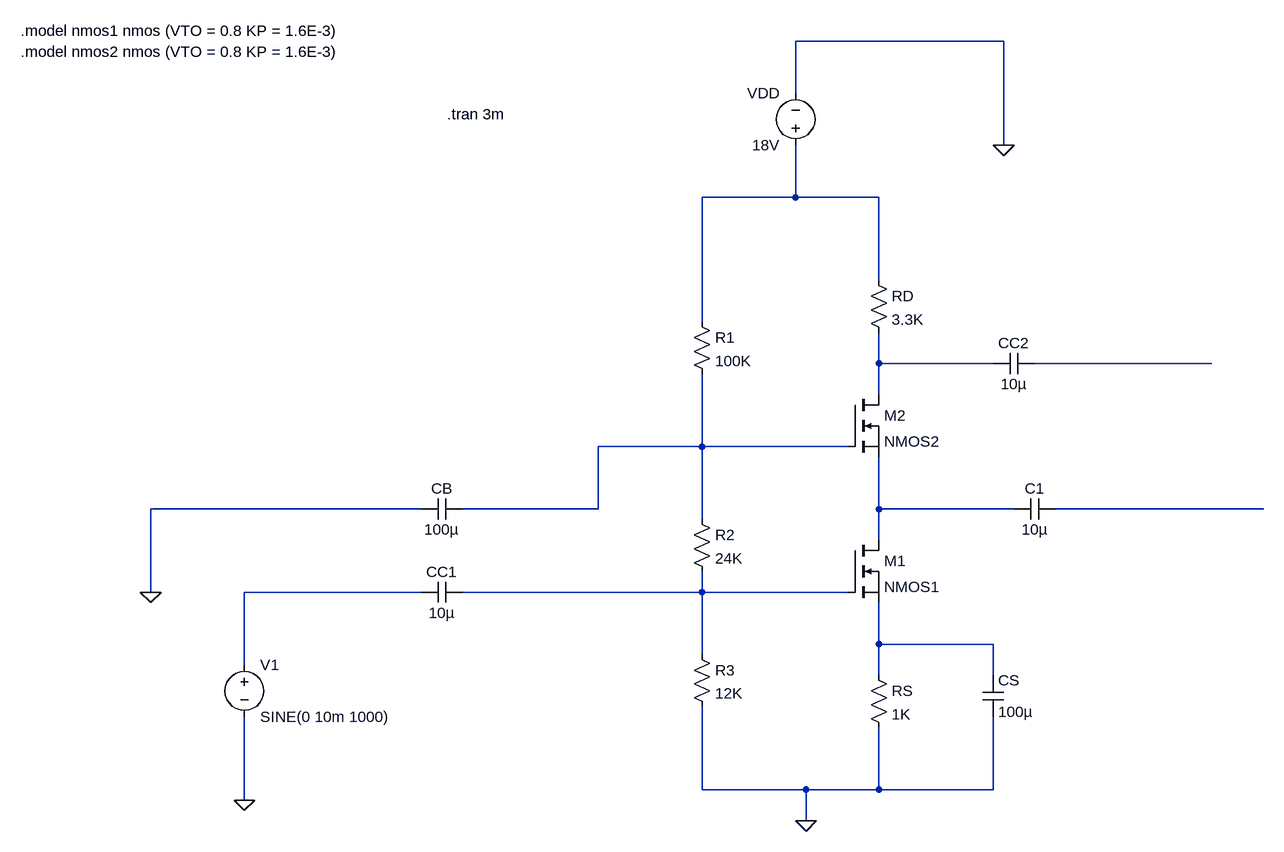
[diagram p0: schematic ec_exp2.asc]
ec_exp2.asc, the LTspice schematic file:
Version 4
SHEET 1 1188 680
WIRE 784 -816 464 -816
WIRE 464 -736 464 -816
WIRE 784 -656 784 -816
WIRE 464 -576 464 -656
WIRE 464 -576 320 -576
WIRE 592 -576 464 -576
WIRE 592 -448 592 -576
WIRE 320 -384 320 -576
WIRE 592 -320 592 -368
WIRE 768 -320 592 -320
WIRE 1104 -320 832 -320
WIRE 592 -272 592 -320
WIRE 320 -192 320 -304
WIRE 320 -192 160 -192
WIRE 544 -192 320 -192
WIRE -112 -96 -528 -96
WIRE 160 -96 160 -192
WIRE 160 -96 -48 -96
WIRE 592 -96 592 -176
WIRE 800 -96 592 -96
WIRE 1184 -96 864 -96
WIRE 320 -80 320 -192
WIRE 592 -48 592 -96
WIRE -528 32 -528 -96
WIRE -112 32 -384 32
WIRE 320 32 320 0
WIRE 320 32 -48 32
WIRE 544 32 320 32
WIRE 592 112 592 48
WIRE 768 112 592 112
WIRE 320 128 320 32
WIRE -384 144 -384 32
WIRE 592 160 592 112
WIRE 768 160 768 112
WIRE 320 336 320 208
WIRE 480 336 320 336
WIRE 592 336 592 240
WIRE 592 336 480 336
WIRE 768 336 768 224
WIRE 768 336 592 336
WIRE -384 352 -384 224
WIRE 480 384 480 336
FLAG 480 384 0
FLAG -384 352 0
FLAG -528 32 0
FLAG 784 -656 0
SYMBOL cap -48 16 R90
WINDOW 0 0 32 VBottom 2
WINDOW 3 32 32 VTop 2
SYMATTR InstName CC1
SYMATTR Value 10µ
SYMBOL voltage -384 128 R0
WINDOW 123 0 0 Left 0
WINDOW 39 0 0 Left 0
SYMATTR InstName V1
SYMATTR Value SINE(0 10m 1000)
SYMBOL res 304 112 R0
SYMATTR InstName R3
SYMATTR Value 12K
SYMBOL nmos 544 -48 R0
SYMATTR InstName M1
SYMATTR Value NMOS1
SYMBOL cap 752 160 R0
SYMATTR InstName CS
SYMATTR Value 100µ
SYMBOL res 576 144 R0
SYMATTR InstName RS
SYMATTR Value 1K
SYMBOL nmos 544 -272 R0
SYMATTR InstName M2
SYMATTR Value NMOS2
SYMBOL cap 864 -112 R90
WINDOW 0 0 32 VBottom 2
WINDOW 3 32 32 VTop 2
SYMATTR InstName C1
SYMATTR Value 10µ
SYMBOL cap -48 -112 R90
WINDOW 0 0 32 VBottom 2
WINDOW 3 32 32 VTop 2
SYMATTR InstName CB
SYMATTR Value 100µ
SYMBOL res 304 -96 R0
SYMATTR InstName R2
SYMATTR Value 24K
SYMBOL res 304 -400 R0
SYMATTR InstName R1
SYMATTR Value 100K
SYMBOL res 576 -464 R0
SYMATTR InstName RD
SYMATTR Value 3.3K
SYMBOL cap 832 -336 R90
WINDOW 0 0 32 VBottom 2
WINDOW 3 32 32 VTop 2
SYMATTR InstName CC2
SYMATTR Value 10µ
SYMBOL voltage 464 -640 R180
WINDOW 0 24 96 Left 2
WINDOW 3 24 16 Left 2
WINDOW 123 0 0 Left 0
WINDOW 39 0 0 Left 0
SYMATTR InstName VDD
SYMATTR Value 18V
TEXT -728 -800 Left 2 !.model nmos2 nmos (VTO = 0.8 KP = 1.6E-3)
TEXT -728 -832 Left 2 !.model nmos1 nmos (VTO = 0.8 KP = 1.6E-3)
TEXT -72 -704 Left 2 !.tran 3m

The netlist it stands for:
* ec_exp2.asc
CC1 N008 N007 10µ
V1 N007 0 SINE(0 10m 1000)
R3 N008 0 12K
M1 N005 N008 N009 N009 NMOS1
CS N009 0 100µ
RS N009 0 1K
M2 N002 N004 N005 N005 NMOS2
C1 N006 N005 10µ
CB N004 0 100µ
R2 N004 N008 24K
R1 N001 N004 100K
RD N001 N002 3.3K
CC2 N003 N002 10µ
VDD N001 0 18V
.model NMOS NMOS
.model PMOS PMOS
.lib standard.mos
.model nmos2 nmos (VTO = 0.8 KP = 1.6E-3)
.model nmos1 nmos (VTO = 0.8 KP = 1.6E-3)
.tran 3m
.backanno
.end